# EAGLE design SDLbeerlight (EAGLE 6.6.0)
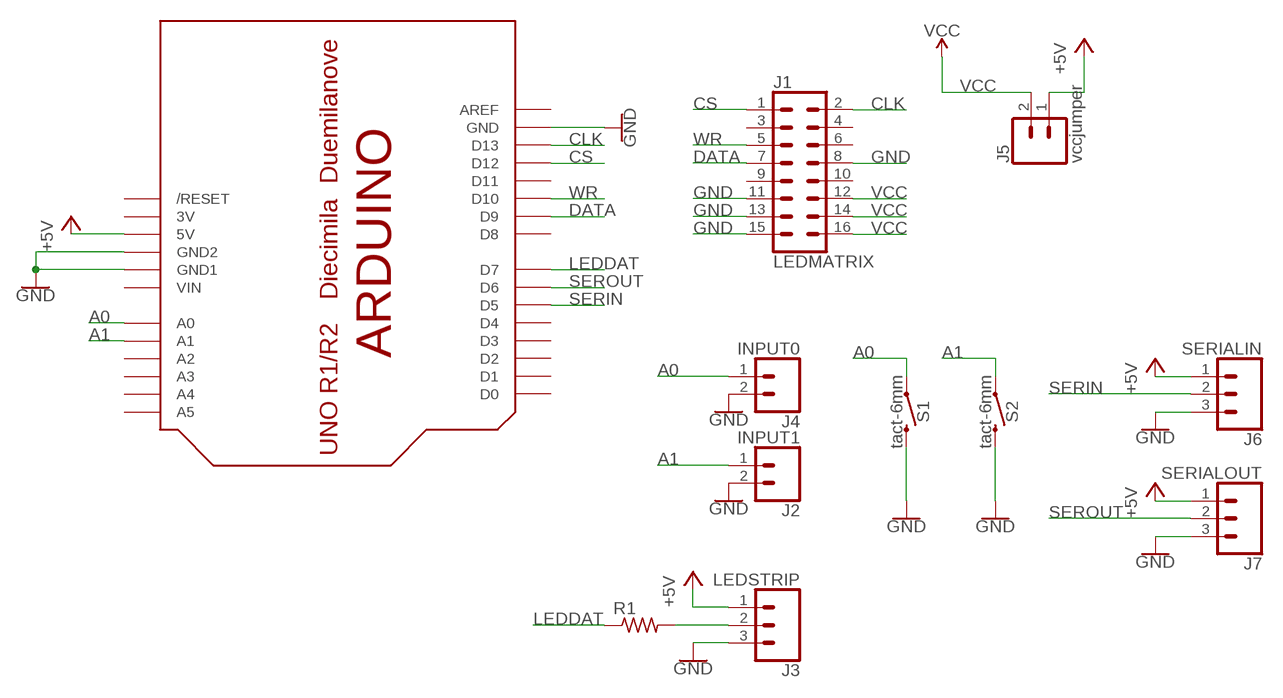
[diagram p0: schematic, sheet 1]

## Parts
J1  LEDMATRIX  CONN_08X2  [2X8]
J2  INPUT1  CONN_02PTH3  [1X02_LONGPADS]
J3  LEDSTRIP  CONN_03LONGPADS  [1X03_LONGPADS]
J4  INPUT0  CONN_02PTH3  [1X02_LONGPADS]
J5  vccjumper  CONN_02LOCK_LONGPADS  [1X02_LOCK_LONGPADS]
J6  SERIALIN  CONN_03LONGPADS  [1X03_LONGPADS]
J7  SERIALOUT  CONN_03LONGPADS  [1X03_LONGPADS]
R1  R-US_0204/7  [0204/7]
S1  tact-6mm  MOMENTARY-SWITCH-SPST-PTH-6.0MM  [TACTILE_SWITCH_PTH_6.0MM]
S2  tact-6mm  MOMENTARY-SWITCH-SPST-PTH-6.0MM  [TACTILE_SWITCH_PTH_6.0MM]
U$2  ARDUINOUNO  [ARDUINO]

## Nets
+5V: J3.1 J5.1 J6.1 J7.1 U$2.5V
A0: J4.1 S1.1 U$2.A0
A1: J2.1 S2.1 U$2.A1
CLK: J1.2 U$2.D13
CS: J1.1 U$2.D12
DATA: J1.7 U$2.D9
GND: J1.8 J1.11 J1.13 J1.15 J2.2 J3.3 J4.2 J6.3 J7.3 S1.3 S2.3 U$2.GND U$2.GND1 U$2.GND2
LEDDAT: R1.1 U$2.D7
N$1: J3.2 R1.2
SERIN: J6.2 U$2.D5
SEROUT: J7.2 U$2.D6
VCC: J1.12 J1.14 J1.16 J5.2
WR: J1.5 U$2.D10
Unconnected: J1.3 J1.4 J1.6 J1.9 J1.10 U$2.A2 U$2.A3 U$2.A4 U$2.A5 U$2.AREF U$2.D0 U$2.D1 U$2.D2 U$2.D3 U$2.D4 U$2.D8 U$2.D11 U$2.RESET(/RESET)

## Power pins joined to a net without a drawn wire
3V: U$2.3V
VIN: U$2.VIN

## Library data of the parts
J1 = SparkFun-Connectors:CONN_08X2: Multi connection point. Often used as Generic Header-pin footprint for 0.1 inch spaced/style header connections You can populate with any combo of single row headers, but if you'd like an exact match, check this: Header - 2x8 (Male, 0.1") <https://www.sparkfun.com/products/13156> (PRT-13156) On any of the 0.1 inch spaced packages, you can populate with these: Break Away Headers - Straight <https://www.sparkfun.com/products/116> (PRT-00116) Break Away Male Headers - Right Angle <https://www.sparkfun.com/products/553> (PRT-00553) Female Headers <https://www.sparkfun.com/products/115> (PRT-00115) Break Away Headers - Machine Pin <https://www.sparkfun.com/products/117> (PRT-00117) Break Away Female Headers - Swiss Machine Pin <https://www.sparkfun.com/products/743> (PRT-00743)
J2 J4 J5 = SparkFun-Connectors:CONN_02: Multi connection point. Often used as Generic Header-pin footprint for 0.1 inch spaced/style header connections On any of the 0.1 inch spaced packages, you can populate with these: Break Away Headers - Straight <https://www.sparkfun.com/products/116> (PRT-00116) Break Away Male Headers - Right Angle <https://www.sparkfun.com/products/553> (PRT-00553) Female Headers <https://www.sparkfun.com/products/115> (PRT-00115) Break Away Headers - Machine Pin <https://www.sparkfun.com/products/117> (PRT-00117) Break Away Female Headers - Swiss Machine Pin <https://www.sparkfun.com/products/743> (PRT-00743) For SCREWTERMINALS and SPRING TERMINALS visit here: Screw Terimnals on SparkFun.com <https://www.sparkfun.com/search/results?term=Screw+Terminals> (5mm/3.5mm/2.54mm spacing) This device is also useful as a general connection point to wire up your design to another part of your project. Our various solder wires solder well into these plated through hole pads. Hook-Up Wire - Assortment (Stranded, 22 AWG) <https://www.sparkfun.com/products/11375> (PRT-11375) Hook-Up Wire - Assortment (Solid Core, 22 AWG) <https://www.sparkfun.com/products/11367> (PRT-11367) View the entire wire category on our website here <https://www.sparkfun.com/categories/141> Special notes: Molex polarized connector foot print use with: PRT-08233 with associated crimp pins and housings. 2.54_SCREWTERM for use with PRT-10571. 3.5mm Screw Terminal footprints for PRT-08084 5mm Screw Terminal footprints for use with PRT-08432
J3 J6 J7 = SparkFun-Connectors:CONN_03: Multi connection point. Often used as Generic Header-pin footprint for 0.1 inch spaced/style header connections On any of the 0.1 inch spaced packages, you can populate with these: Break Away Headers - Straight <https://www.sparkfun.com/products/116> (PRT-00116) Break Away Male Headers - Right Angle <https://www.sparkfun.com/products/553> (PRT-00553) Female Headers <https://www.sparkfun.com/products/115> (PRT-00115) Break Away Headers - Machine Pin <https://www.sparkfun.com/products/117> (PRT-00117) Break Away Female Headers - Swiss Machine Pin <https://www.sparkfun.com/products/743> (PRT-00743) Stackable Header - 3 Pin (Female, 0.1") <https://www.sparkfun.com/products/13875> (PRT-13875) For SCREWTERMINALS and SPRING TERMINALS visit here: Screw Terimnals on SparkFun.com <https://www.sparkfun.com/search/results?term=Screw+Terminals> (5mm/3.5mm/2.54mm spacing) This device is also useful as a general connection point to wire up your design to another part of your project. Our various solder wires solder well into these plated through hole pads. Hook-Up Wire - Assortment (Stranded, 22 AWG) <https://www.sparkfun.com/products/11375> (PRT-11375) Hook-Up Wire - Assortment (Solid Core, 22 AWG) <https://www.sparkfun.com/products/11367> (PRT-11367) View the entire wire category on our website here <https://www.sparkfun.com/categories/141> Special notes: Molex polarized connector foot print use with SKU : PRT-08232 with associated crimp pins and housings.
R1 = adafruit:R-US_: RESISTOR, American symbol
S1 S2 = SparkFun-Switches:MOMENTARY-SWITCH-SPST: Momentary Switch (Pushbutton) - SPST Normally-open (NO) SPST momentary switches (buttons, pushbuttons). Variants PTH-12MM - 12mm square, through-hole Momentary Pushbutton Switch - 12mm Square <https://www.sparkfun.com/products/9190> (COM-09190) PTH-6.0MM, PTH-6.0MM-KIT - 6.0mm square, through-hole Mini Pushbutton Switch <https://www.sparkfun.com/products/97> (COM-00097) KIT package intended for soldering kit's - only one side of pads' copper is exposed. PTH-RIGHT-ANGLE-KIT - Right-angle, through-hole Right Angle Tactile Button <https://www.sparkfun.com/products/10791> - Used on SparkFun BigTime Watch Kit <https://www.sparkfun.com/products/11734> SMD-12MM - 12mm square, surface-mount Tactile Button - SMD (12mm) <https://www.sparkfun.com/products/12993> (COM-12993) Used on SparkFun PicoBoard <https://www.sparkfun.com/products/11888> SMD-4.5MM - 4.5mm Square Trackball Switch Used on SparkFun Blackberry Trackballer Breakout <https://www.sparkfun.com/products/13169> SMD-4.6MMX2.8MM - 4.60mm x 2.80mm, surface mount Used on SparkFun SAMD21 Mini Breakout <https://www.sparkfun.com/products/13664> SMD-5.2MM, SMD-5.2-REDUNDANT - 5.2mm square, surface-mount Mini Pushbutton Switch - SMD <https://www.sparkfun.com/products/8720> (COM-08720) Used on Arduino Pro Mini <https://www.sparkfun.com/products/11114> REDUNDANT package connects both switch circuits together SMD-6.0X3.5MM - 6.0 x 3.5mm, surface mount Momentary Reset Switch SMD <https://www.sparkfun.com/products/8229> (COM-08229) SMD-6.2MM-TALL - 6.2mm square, surface mount Tactile Button - SMD (6mm) <https://www.sparkfun.com/products/12992> Used on SparkFun Digital Sandbox <https://www.sparkfun.com/products/12651> SMD-RIGHT-ANGLE - Right-angle, surface mount Used on SparkFun Block for Intel® Edison - Arduino <https://www.sparkfun.com/products/13036>; PROD_ID: SWCH-08441; SF_SKU: COM-00097
U$2 = adafruit:ARDUINO: Arduino Diecimila/Duemilanove Make a shield with ease, this package has all the named pins as well as the two mounting drill holes and an outline of the USB and DC power connector. The outline is on the DIMENSION layer, so if your board house uses it they will cut the outline to match. http://www.ladyada.net/library/pcb/eaglelibrary.html

## Board
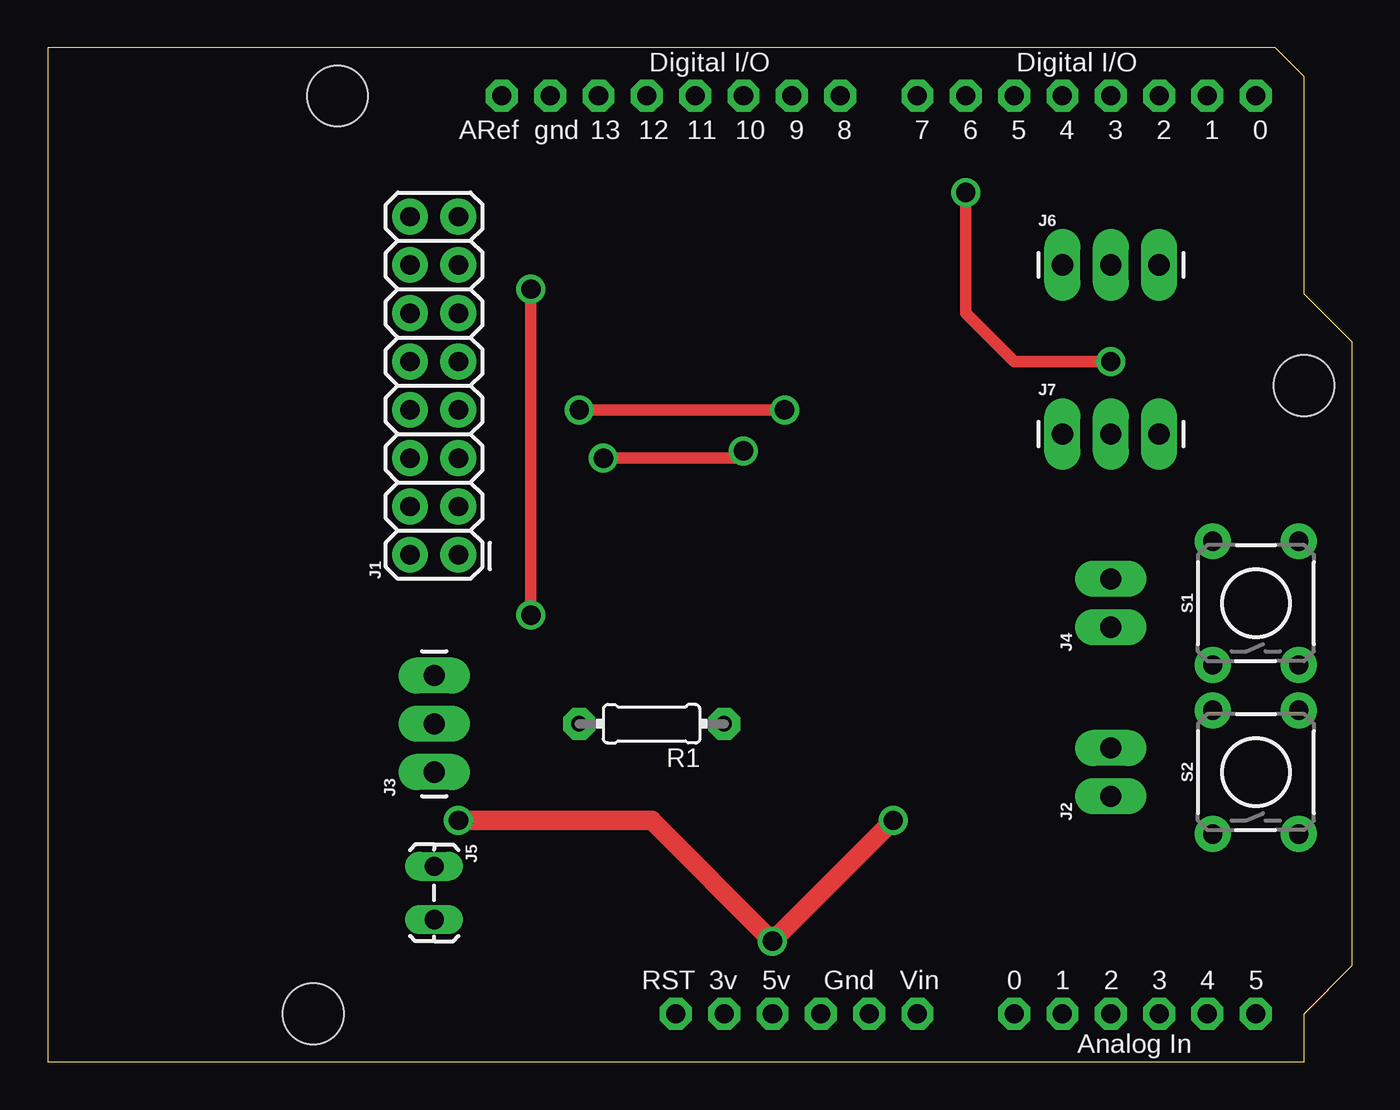
[diagram p1: board, top side]
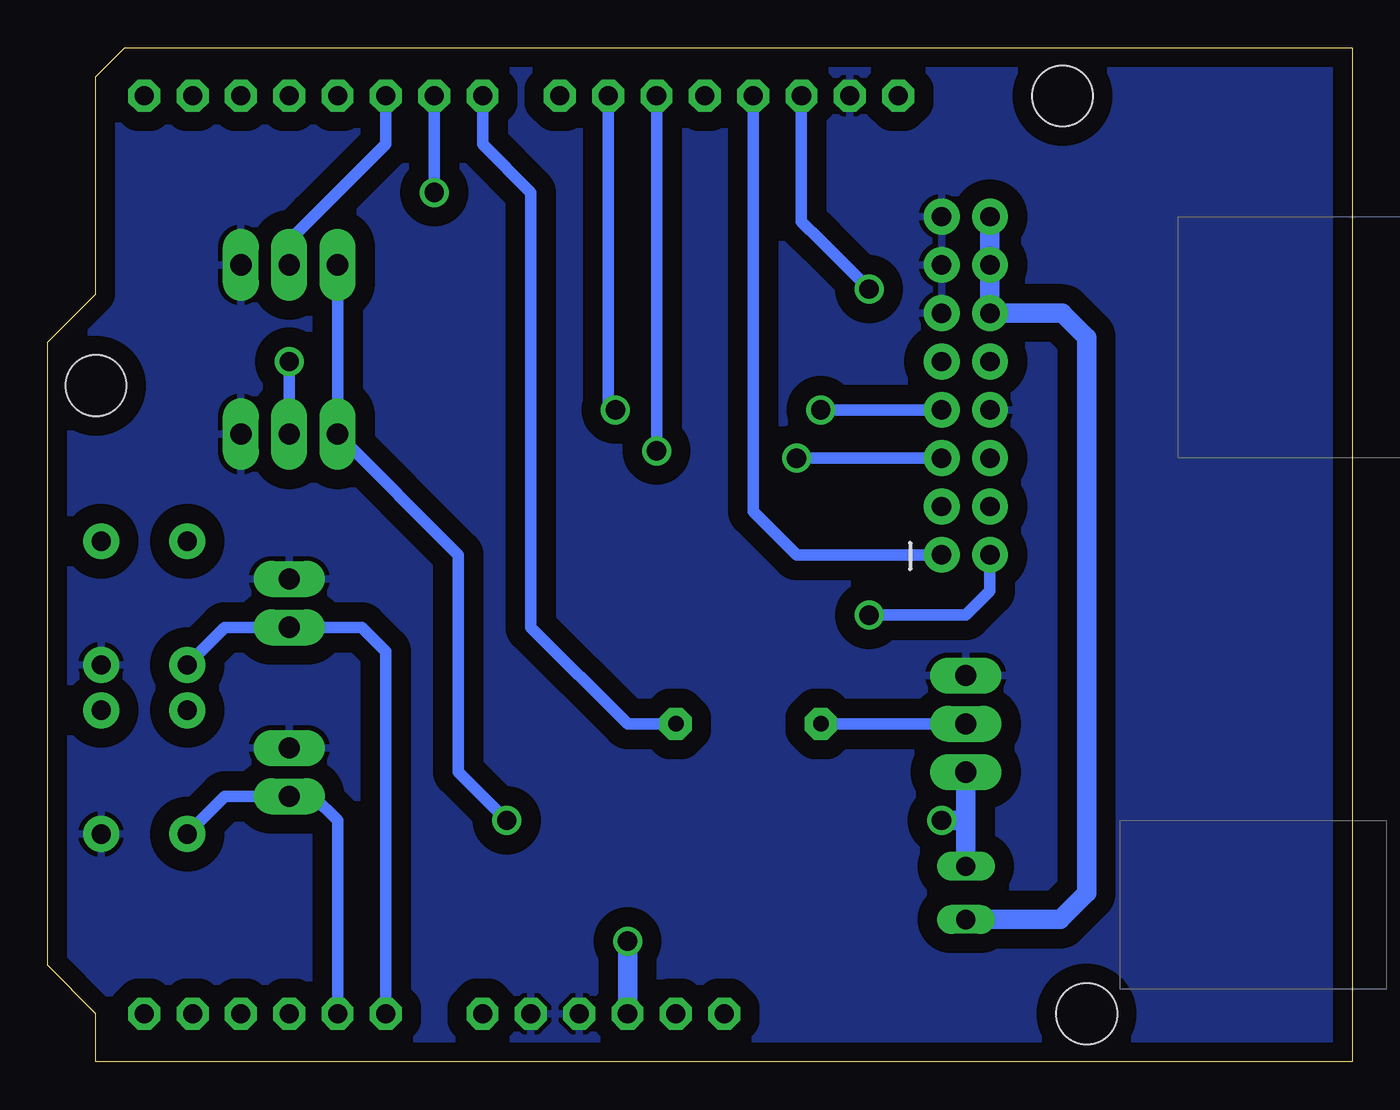
[diagram p2: board, bottom side, seen from below]

Size 68.58 x 53.34 mm. Coordinates in mm from the lower left corner, seen from the top.
Copper layers (1*16): Top 0.035mm / dielectric 1.5mm / Bottom 0.035mm
Design rules "default": minimum track width 10mil, minimum drill 24mil, track to track 8mil, track to pad 8mil, pad to pad 8mil, via to via 8mil, smd to smd 8mil, copper to edge 40mil, drill to drill 8mil, minimum pad ring 10mil, minimum via ring 8mil, stop-mask expansion 4mil, vias tented up to drill 0mil, thermal gap 10mil

### Footprints (pad centres in the part's own frame; a part is rotated, then mirrored left to right if it is on the bottom)
2X8 = drill 1.016 pad 1.88: 1 0,0; 2 0,2.54; 3 2.54,0; 4 2.54,2.54; 5 5.08,0; 6 5.08,2.54; 7 7.62,0; 8 7.62,2.54; 9 10.16,0; 10 10.16,2.54; 11 12.7,0; 12 12.7,2.54; 13 15.24,0; 14 15.24,2.54; 15 17.78,0; 16 17.78,2.54
1X02_LONGPADS = drill 1.118 pad 1.88 long: 1 0,0; 2 2.54,0
1X03_LONGPADS = drill 1.118 pad 1.88 long: 1 0,0; 2 2.54,0; 3 5.08,0
1X02_LOCK_LONGPADS = drill 1.016 long: 1 -0.127,0; 2 2.667,0
0204/7 = drill 0.813 pad 1.676 octagon: 1 -3.81,0; 2 3.81,0
TACTILE_SWITCH_PTH_6.0MM = drill 1.016 pad 1.88: 1 -3.251,2.261; 2 3.251,2.261; 3 -3.251,-2.261; 4 3.251,-2.261
ARDUINO = drill 1 pad 1.676 octagon: 3V 35.56,2.54; 5V 38.1,2.54; A0 50.8,2.54; A1 53.34,2.54; A2 55.88,2.54; A3 58.42,2.54; A4 60.96,2.54; A5 63.5,2.54; AREF 23.876,50.8; D0 63.5,50.8; D1 60.96,50.8; D2 58.42,50.8; D3 55.88,50.8; D4 53.34,50.8; D5 50.8,50.8; D6 48.26,50.8; D7 45.72,50.8; D8 41.656,50.8; D9 39.116,50.8; D10 36.576,50.8; D11 34.036,50.8; D12 31.496,50.8; D13 28.956,50.8; GND 26.416,50.8; GND1 43.18,2.54; GND2 40.64,2.54; RESET 33.02,2.54; VIN 45.72,2.54 | hole 3.2: 15.24,50.8; 66.04,35.56; 13.97,2.54

### Placement (x,y rotation side)
J1  21.59,26.67 90 top
J2  55.88,13.97 90 top
J3  20.32,15.24 90 top
J4  55.88,22.86 90 top
J5  20.32,10.16 270 top
J6  53.34,41.91 0 top
J7  53.34,33.02 0 top
R1  31.75,17.78 180 top
S1  63.5,24.13 90 top
S2  63.5,15.24 90 top
U$2  0,0 0 top

### Tracks (layer width: path | path; a pad name or v marks a point on that pad's centre or on a via)
+5V  (via drill 1.02)
  Top 1.016: v21.59,12.7 22.86,12.7 31.75,12.7 v38.1,6.35 v44.45,12.7
  Bottom 0.61: J6.1 J7.1 46.99,26.67 46.99,15.24 v44.45,12.7
  Bottom 1.016: U$2.5V v38.1,6.35 | 20.45,10.16 J5.1 | J3.1 J5.1 | J5.1 20.32,12.7 v21.59,12.7
A0
  Bottom 0.61: U$2.A0 50.8,21.59 52.07,22.86 J4.1 59.26,22.86 S1.1
A1
  Bottom 0.61: U$2.A1 53.34,12.7 54.61,13.97 J2.1 59.26,13.97 S2.1
CLK  (via drill 1.02)
  Top 0.61: v25.4,40.64 v25.4,23.5
  Bottom 0.61: v25.4,23.5 20.32,23.5 19.05,24.77 J1.2 | U$2.D13 28.96,44.2 27.94,43.18 v25.4,40.64
CS
  Bottom 0.61: U$2.D12 31.5,44.2 31.5,28.96 29.21,26.67 26.67,26.67 24.13,26.67 J1.1
DATA  (via drill 1.02)
  Top 0.61: v38.73,34.29 38.1,34.29 v27.94,34.29
  Bottom 0.61: U$2.D9 39.12,34.29 v38.73,34.29 | v27.94,34.29 J1.7
GND
  pour Bottom (isolate 1.016): -1.27,53.34 -1.27,0 68.58,0 68.58,53.34
LEDDAT
  Bottom 0.61: R1.1 36.83,17.78 38.1,17.78 43.18,22.86 | 43.18,22.86 43.18,26.67 | U$2.D7 45.72,48.26 43.18,45.72 43.18,22.86
N$1
  Bottom 0.61: R1.2 J3.2
SERIN
  Bottom 0.61: U$2.D5 50.8,48.26 54.61,44.45 55.88,43.18 J6.2
SEROUT  (via drill 1.02)
  Top 0.61: v48.26,45.72 48.26,39.37 50.8,36.83 v55.88,36.83
  Bottom 0.61: J7.2 v55.88,36.83 | v48.26,45.72 U$2.D6
VCC
  Bottom 1.016: J5.2 15.37,7.49 13.97,8.89 13.97,38.1 15.24,39.37 J1.12 J1.14 J1.16
WR  (via drill 1.02)
  Top 0.61: v36.58,32.13 36.2,31.75 v29.21,31.75
  Bottom 0.61: U$2.D10 36.58,47.24 v36.58,32.13 | v29.21,31.75 J1.5